# EAGLE design board (EAGLE 6.4)
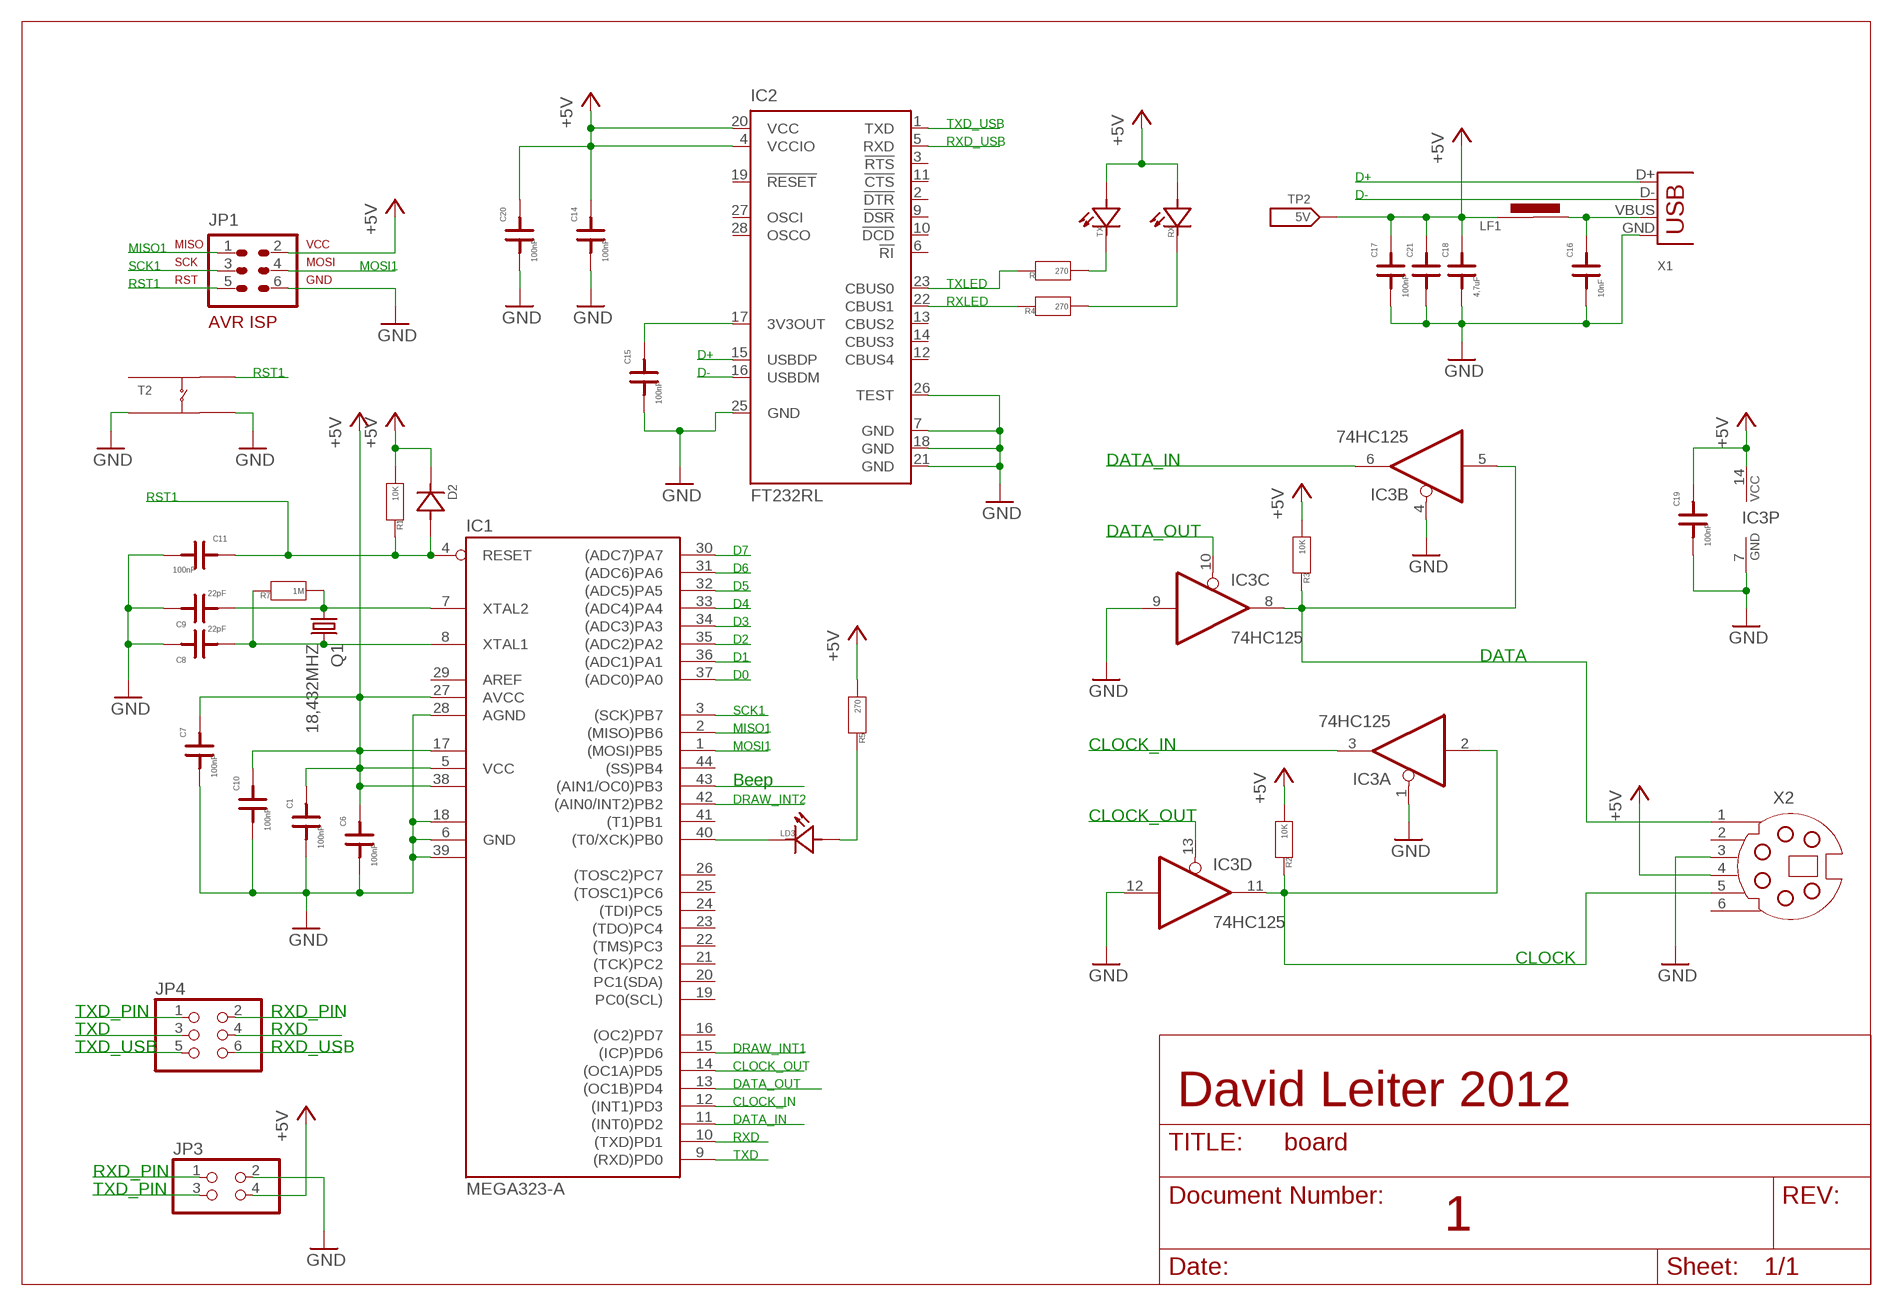
[diagram p0: schematic, sheet 1, part 1 of 2]
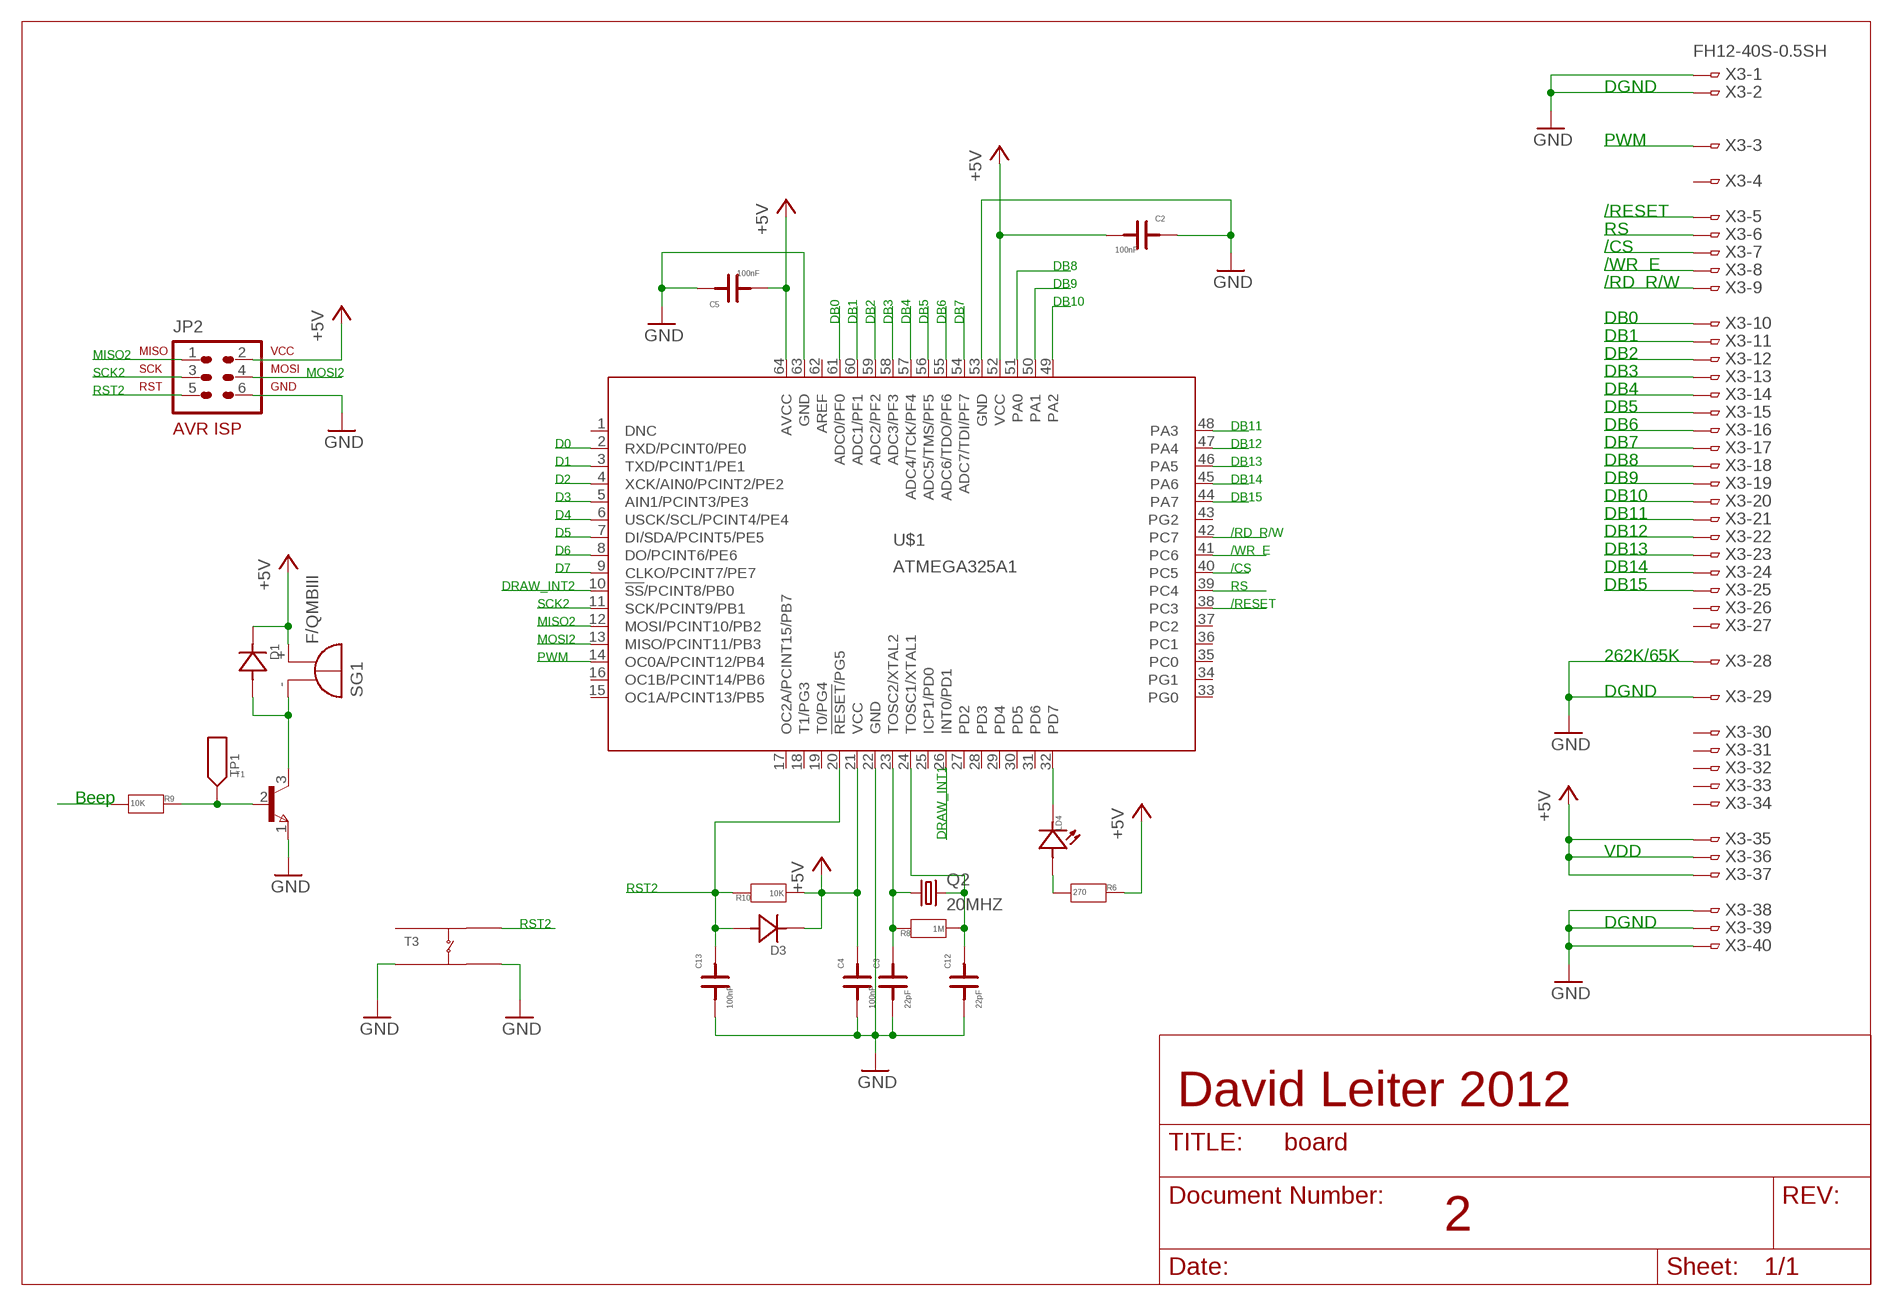
[diagram p1: schematic, sheet 1, part 2 of 2]

## Parts
C1  100nF  C1  [0805F]
C2  100nF  C1  [0805F]
C3  22pF  C1  [0805F]
C4  100nF  C1  [0805F]
C5  100nF  C1  [0805F]
C6  100nF  C1  [0805F]
C7  100nF  C1  [0805F]
C8  22pF  C1  [0805F]
C9  22pF  C1  [0805F]
C10  100nF  C1  [0805F]
C11  100nF  C1  [0805F]
C12  22pF  C1  [0805F]
C13  100nF  C1  [0805F]
C14  100nF  C1  [0805F]
C15  100nF  C1  [0805F]
C16  10nF  C1  [0805F]
C17  100nF  C1  [0805F]
C18  4,7uF  C1  [0805F]
C19  100nF  C1  [0805F]
C20  100nF  C1  [0805F]
C21  C1  [0805F]
D1  DSOD80  [SOD-80]
D2  DSOD80  [SOD-80]
D3  DSOD80  [SOD-80]
IC1  MEGA323-A  [TQFP44]
IC2  FT232RL  [SSOP28]
IC3  74HC125  74HCT125D  [SO14]
JP1  ISP1  AVR-ISP-6VERT  [AVR-ISP-6]
JP2  ISP2  AVR-ISP-6VERT  [AVR-ISP-6]
JP3  PINHD-2X2/90  [2X02/90]
JP4  PINHD-2X3  [2X03]
LD3  LEDSMD  [0805LED]
LD4  LEDSMD  [0805LED]
LF1  FERRIT0805  [0805]
Q1  18,432MHZ  CRYSTALHC49UP  [HC49UP]
Q2  20MHZ  CRYSTALHC49UP  [HC49UP]
R  270  R1  [0805]
R1  10K  R1  [0805]
R2  10K  R1  [0805]
R3  10K  R1  [0805]
R4  270  R1  [0805]
R5  270  R1  [0805]
R6  270  R1  [0805]
R7  1M  R1  [0805]
R8  1M  R1  [0805]
R9  10K  R1  [0805]
R10  10K  R1  [0805]
RX  LEDSMD  [0805LED]
SG1  F/QMBIII  [F/QMBIII]
T1  BC817  [SOT-23]
T2  TASTERSMD  [TASTE_SMD]
T3  TASTERSMD  [TASTE_SMD]
TP1  TESTPOINT  [TESTPOINT]
TP2  5V  TESTPOINT  [TESTPOINT]
TX  LEDSMD  [0805LED]
U$1  ATMEGA325A1  [TQFP64]
X1  USB-B-H  [USB-B-H]
X2  SSV-G06  [SSV-BC06]
X3  FH12-40S-0.5SH  [FH12-40S-0.5SH]

## Nets
+5V: C1.2 C2.1 C4.2 C5.1 C6.2 C7.2 C10.2 C14.2 C17.2 C18.2 C19.2 C20.2 C21.2 D1.1(K) D2.1(K) D3.1(K) IC1.5(VCC) IC1.17(VCC1) IC1.27(AVCC) IC1.38(VCC2) IC2.4(VCCIO) IC2.20(VCC) IC3.14(P:VCC) JP1.2 JP2.2 JP3.4 LF1.1 R1.1 R2.1 R3.1 R5.1 R6.2 R10.1 RX.A SG1.+(-) TP2.P$1(TP) TX.A U$1.21(VCC) U$1.52(VCC) U$1.64(AVCC) X2.4 X3.35 X3.36 X3.37
/CS: U$1.40(PC5) X3.7
/RD: U$1.42(PC7) X3.9
/RESET: U$1.38(PC3) X3.5
/WR: U$1.41(PC6) X3.8
BEEP: IC1.43((AIN1/OC0)PB3) R9.1
CLOCK: IC3.2(A:I) IC3.11(D:O) R2.2 X2.5
CLOCK_IN: IC1.12((INT1)PD3) IC3.3(A:O)
CLOCK_OUT: IC1.14((OC1A)PD5) IC3.13(D:OE)
D0: IC1.37((ADC0)PA0) U$1.2(RXD/PCINT0/PE0)
D1: IC1.36((ADC1)PA1) U$1.3(TXD/PCINT1/PE1)
D2: IC1.35((ADC2)PA2) U$1.4(XCK/AIN0/PCINT2/PE2)
D3: IC1.34((ADC3)PA3) U$1.5(AIN1/PCINT3/PE3)
D4: IC1.33((ADC4)PA4) U$1.6(USCK/SCL/PCINT4/PE4)
D5: IC1.32((ADC5)PA5) U$1.7(DI/SDA/PCINT5/PE5)
D6: IC1.31((ADC6)PA6) U$1.8(DO/PCINT6/PE6)
D7: IC1.30((ADC7)PA7) U$1.9(CLKO/PCINT7/PE7)
D+: IC2.15(USBDP) X1.D+
D-: IC2.16(USBDM) X1.D-
DATA: IC3.5(B:I) IC3.8(C:O) R3.2 X2.1
DATA_IN: IC1.11((INT0)PD2) IC3.6(B:O)
DATA_OUT: IC1.13((OC1B)PD4) IC3.10(C:OE)
DB0: U$1.61(ADC0/PF0) X3.10
DB1: U$1.60(ADC1/PF1) X3.11
DB2: U$1.59(ADC2/PF2) X3.12
DB3: U$1.58(ADC3/PF3) X3.13
DB4: U$1.57(ADC4/TCK/PF4) X3.14
DB5: U$1.56(ADC5/TMS/PF5) X3.15
DB6: U$1.55(ADC6/TDO/PF6) X3.16
DB7: U$1.54(ADC7/TDI/PF7) X3.17
DB8: U$1.51(PA0) X3.18
DB9: U$1.50(PA1) X3.19
DB10: U$1.49(PA2) X3.20
DB11: U$1.48(PA3) X3.21
DB12: U$1.47(PA4) X3.22
DB13: U$1.46(PA5) X3.23
DB14: U$1.45(PA6) X3.24
DB15: U$1.44(PA7) X3.25
DRAW_INT1: IC1.15((ICP)PD6) U$1.26(INT0/PD1)
DRAW_INT2: IC1.42((AIN0/INT2)PB2) U$1.10(!SS!/PCINT8/PB0)
GND: C1.1 C2.2 C3.1 C4.1 C5.2 C6.1 C7.1 C8.2 C9.2 C10.1 C11.1 C12.1 C13.1 C14.1 C15.1 C16.1 C17.1 C18.1 C19.1 C20.1 C21.1 IC1.6(GND) IC1.18(GND1) IC1.28(AGND) IC1.39(GND2) IC2.7(GND) IC2.18(GND) IC2.21(GND) IC2.25(GND) IC2.26(TEST) IC3.1(A:OE) IC3.4(B:OE) IC3.7(P:GND) IC3.9(C:I) IC3.12(D:I) JP1.6 JP2.6 JP3.2 T1.1(E) T2.B1 T2.B2 T3.B1 T3.B2 U$1.22(GND) U$1.53(GND) U$1.63(GND) X1.GND X2.3 X3.1 X3.2 X3.28 X3.29 X3.38 X3.39 X3.40
MISO1: IC1.2((MISO)PB6) JP1.1
MISO2: JP2.1 U$1.13(MISO/PCINT11/PB3)
MOSI1: IC1.1((MOSI)PB5) JP1.4
MOSI2: JP2.4 U$1.12(MOSI/PCINT10/PB2)
N$1: IC1.40((T0/XCK)PB0) LD3.K
N$2: D1.2(A) SG1.-(+) T1.3(C)
N$3: C8.1 IC1.8(XTAL1) Q1.2 R7.2
N$4: C9.1 IC1.7(XTAL2) Q1.1 R7.1
N$5: LD3.A R5.2
N$6: C3.2 Q2.1 R8.2 U$1.23(TOSC2/XTAL2)
N$7: IC2.22(CBUS1) R4.2
N$8: R9.2 T1.2(B) TP1.P$1(TP)
N$9: LD4.K U$1.32(PD7)
N$10: C15.2 IC2.17(3V3OUT)
N$11: LD4.A R6.1
N$12: R.1 TX.K
N$13: C12.2 Q2.2 R8.1 U$1.24(TOSC1/XTAL1)
N$14: IC2.23(CBUS0) R.2
N$15: R4.1 RX.K
PWM: U$1.14(OC0A/PCINT12/PB4) X3.3
RS: U$1.39(PC4) X3.6
RST1: C11.2 D2.2(A) IC1.4(RESET) JP1.5 R1.2 T2.A2
RST2: C13.2 D3.2(A) JP2.5 R10.2 T3.A2 U$1.20(!RESET!/PG5)
RXD: IC1.10((TXD)PD1) JP4.4
RXD_PIN: JP3.1 JP4.2
RXD_USB: IC2.5(RXD) JP4.6
SCK1: IC1.3((SCK)PB7) JP1.3
SCK2: JP2.3 U$1.11(SCK/PCINT9/PB1)
TXD: IC1.9((RXD)PD0) JP4.3
TXD_PIN: JP3.3 JP4.1
TXD_USB: IC2.1(TXD) JP4.5
VBUS: C16.2 LF1.2 X1.VBUS
Unconnected: IC1.16((OC2)PD7) IC1.19(PC0(SCL)) IC1.20(PC1(SDA)) IC1.21((TCK)PC2) IC1.22((TMS)PC3) IC1.23((TDO)PC4) IC1.24((TDI)PC5) IC1.25((TOSC1)PC6) IC1.26((TOSC2)PC7) IC1.29(AREF) IC1.41((T1)PB1) IC1.44((SS)PB4) IC2.2(!DTR) IC2.3(!RTS) IC2.6(!RI) IC2.9(!DSR) IC2.10(!DCD) IC2.11(!CTS) IC2.12(CBUS4) IC2.13(CBUS2) IC2.14(CBUS3) IC2.19(!RESET) IC2.27(OSCI) IC2.28(OSCO) T2.A1 T3.A1 U$1.1(DNC) U$1.15(OC1A/PCINT13/PB5) U$1.16(OC1B/PCINT14/PB6) U$1.17(OC2A/PCINT15/PB7) U$1.18(T1/PG3) U$1.19(T0/PG4) U$1.25(ICP1/PD0) U$1.27(PD2) U$1.28(PD3) U$1.29(PD4) U$1.30(PD5) U$1.31(PD6) U$1.33(PG0) U$1.34(PG1) U$1.35(PC0) U$1.36(PC1) U$1.37(PC2) U$1.43(PG2) U$1.62(AREF) X2.2 X2.6 X3.4 X3.26 X3.27 X3.30 X3.31 X3.32 X3.33 X3.34

## Notes on the sheet
- DGND
- TXD_USB
- RXD_USB | PWM
- D+
- D-
- /RESET
- RS
- MISO1 | /CS
- SCK1 | MOSI1 | DB8 | /WR  E
- RST1 | TXLED | DB9 | /RD  R/W
- RXLED | DB10
- DB0 | DB1 | DB2 | DB3 | DB4 | DB5 | DB6 | DB7 | DB0
- DB1
- D+ | MISO2 | DB2
- RST1 | D- | SCK2 | MOSI2 | DB3
- RST2 | DB4
- DB5
- DB11 | DB6
- D0 | DB12 | DB7
- DATA_IN | D1 | DB13 | DB8
- D2 | DB14 | DB9
- RST1 | D3 | DB15 | DB10
- D4 | DB11
- DATA_OUT | D5 | /RD  R/W | DB12
- D7 | D6 | /WR  E | DB13
- D6 | D7 | /CS | DB14
- D5 | DRAW_INT2 | RS | DB15
- D4 | SCK2 | /RESET
- D3 | MISO2
- D2 | MOSI2
- D1 | DATA | PWM | 262K/65K
- D0
- DGND
- SCK1
- MISO1
- MOSI1 | CLOCK_IN
- Beep
- DRAW_INT2 | Beep
- CLOCK_OUT
- DRAW_INT1
- VDD
- RST2
- RST2 | DGND
- CLOCK
- TXD_PIN | RXD_PIN
- TXD | RXD
- TXD_USB | RXD_USB | DRAW_INT1
- CLOCK_OUT
- DATA_OUT
- CLOCK_IN | David Leiter 2012 | David Leiter 2012
- DATA_IN
- RXD
- TXD
- RXD_PIN
- TXD_PIN
- 1 | 2

## Library data of the parts
C1-C21 = Gob_L:C
D1-D3 = Gob_L:D: Normale Diode, Typ 1N4148
IC1 = atmel:MEGA323: MICROCONTROLLER 32 Kbytes FLASH 2 Kbytes SRAM 1 Kbytes EEPROM USART 8-channel 10 bit ADC Source: avr.lbr; OC_FARNELL: unknown; OC_NEWARK: unknown
IC2 = ftdichip:FT232R: Source: http://www.ftdichip.com/Documents/DataSheets/DS_FT232R_v104.pdf; MPN: FT232RL; OC_FARNELL: 1146032; OC_NEWARK: 91K9918
IC3 = 74xx-eu:74*125: Quad bus BUFFER, 3-state
JP1 JP2 = avr-7:AVR-ISP-6: AVR ISP-6 Serial Programming Header
JP3 = pinhead:PINHD-2X2: PIN HEADER
JP4 = pinhead:PINHD-2X3: PIN HEADER
LD3 LD4 RX TX = Gob_L:LED: Led´s in allen Formen
LF1 = Gob_L:FERRIT: SMD-Ferrit-Induktor Adimpex PB-322513-900-NT 0,3 Ohm@DC, 90 Ohm@100MHz Imax = 400mA
Q1 Q2 = crystal:CRYSTAL: CRYSTAL; OC_FARNELL: unknown; OC_NEWARK: unknown
R R1-R10 = Gob_L:R: Widerstand 400 mil - 0805 - 1206
SG1 = buzzer:F/QMBIII: BUZZER Source: Buerklin; OC_FARNELL: unknown; OC_NEWARK: unknown
T1 = Gob_L:BC817
T2 T3 = Gob_L:TASTER: Taste SMD, Typ DIPTRONICS DTSM-644K Distrelec-Best.Nr: 200312
TP1 TP2 = Gob_L:TESTPOINT: TestPoint für Messungen etc.
U$1 = atmega325A:ATMEGA325A
X1 = con-usb-3:USB: USB Connectors
X2 = con-yamaichi:SSV-G06: YAMAICHI CONNECTOR; OC_FARNELL: unknown; OC_NEWARK: unknown
X3 = con-hirose:FH12-40S-0.5S: 0.5mm Pitch Connectors For FPC/FFC Source: Data sheet <http://www.hirose.co.jp/cataloge_hp/e58605370.pdf>; MPN: FH12-40S-0.5SH(55); OC_FARNELL: 1324556; OC_NEWARK: 34M6178

## Board
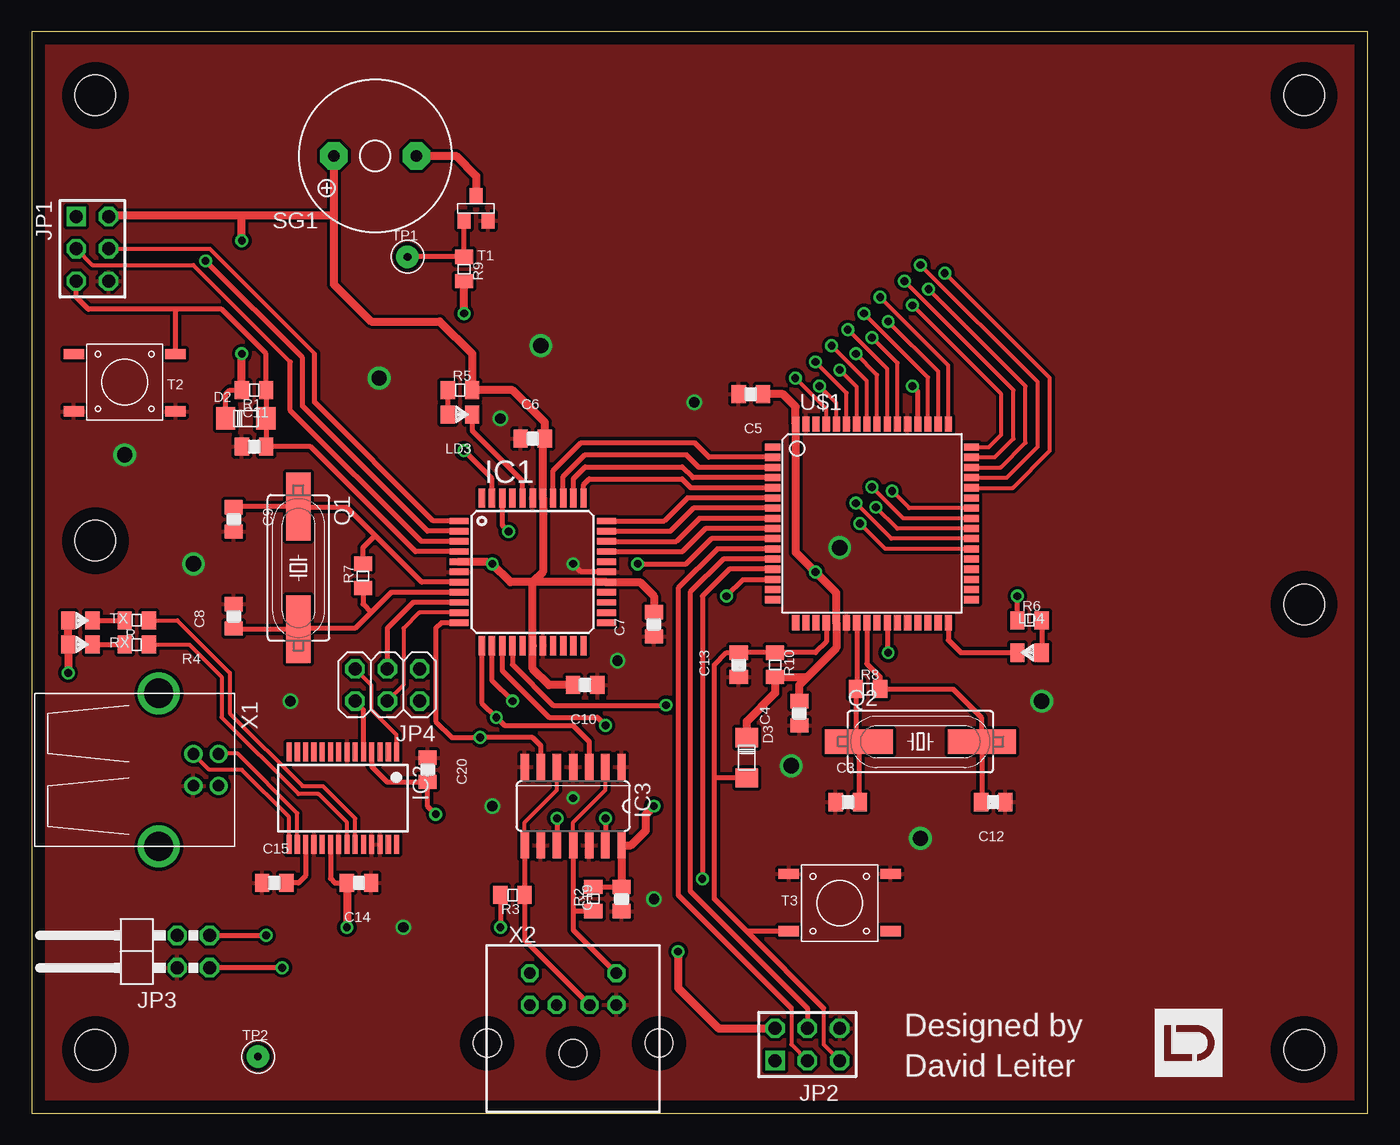
[diagram p2: board, top side]
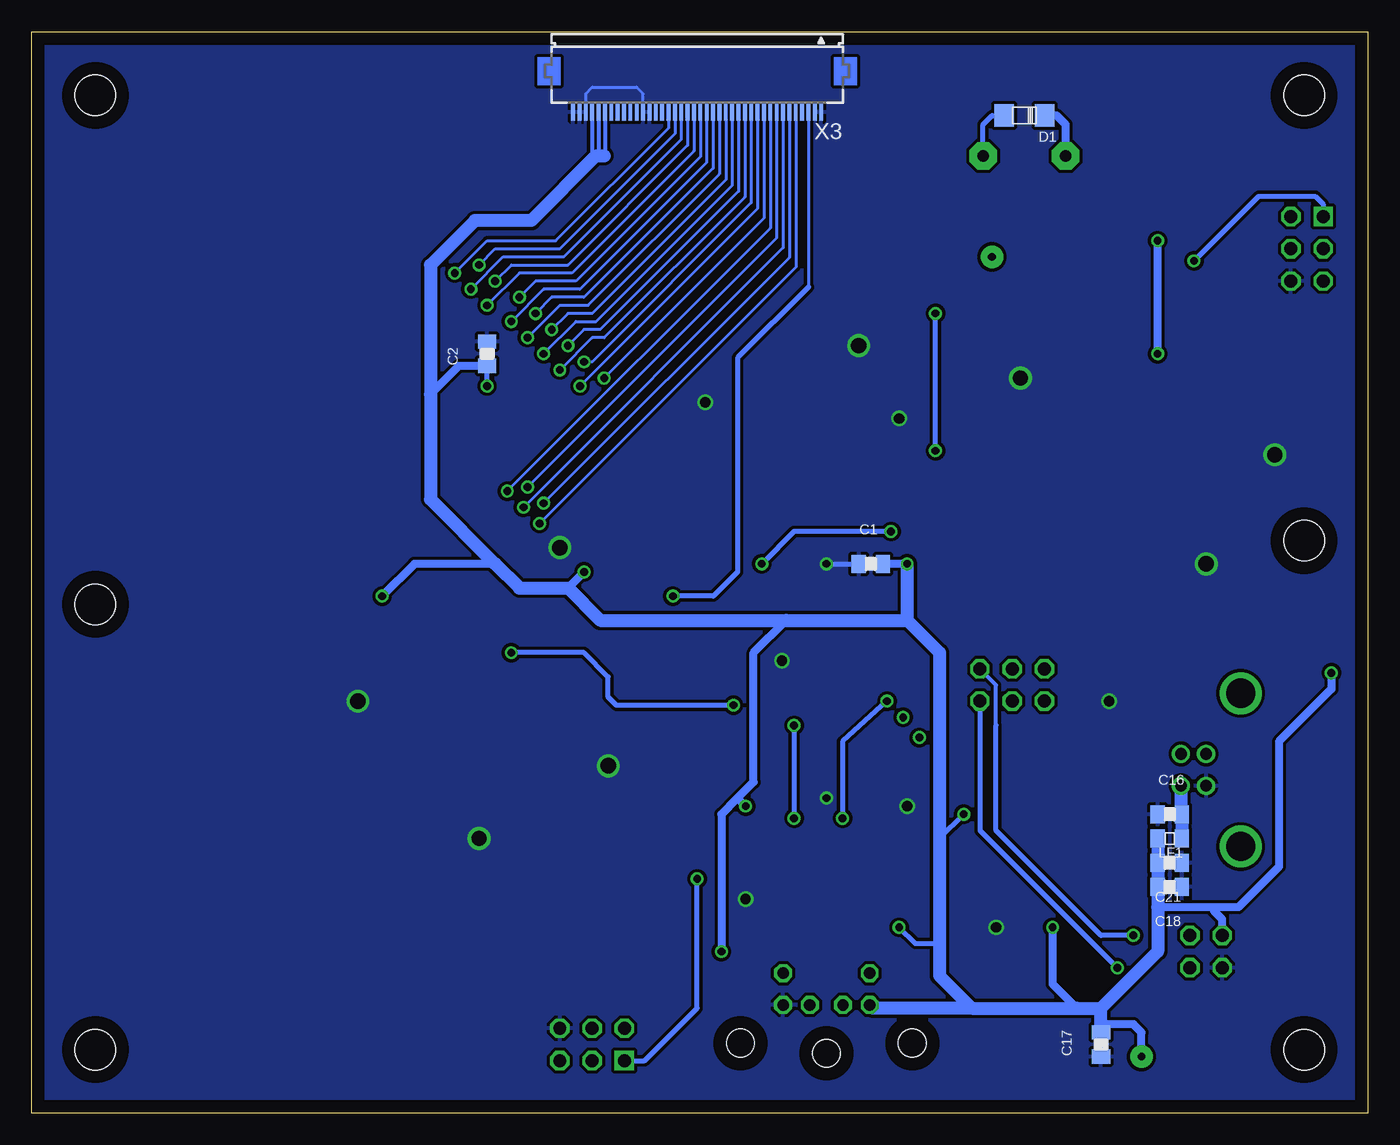
[diagram p3: board, bottom side, seen from below]

Size 105 x 85 mm. Coordinates in mm from the lower left corner, seen from the top.
Outline: 0,0 105,0 105,85 0,85 0,0
Copper layers (1*16): Top 0.035mm / dielectric 1.5mm / Bottom 0.035mm
Design rules "default": minimum track width 10mil, minimum drill 24mil, track to track 8mil, track to pad 8mil, pad to pad 8mil, via to via 8mil, smd to smd 8mil, copper to edge 40mil, drill to drill 8mil, minimum pad ring 10mil, minimum via ring 8mil, stop-mask expansion 4mil, vias tented up to drill 0mil, thermal gap 10mil
Holes 3.2 mm at 5,80 100,80 100,5 5,5 5,45 100,40
Milling: 4 lines

### Footprints (pad centres in the part's own frame; a part is rotated, then mirrored left to right if it is on the bottom)
0805F = smd 1.118 x 1.422: 1 -0.953,0; 2 0.953,0
SOD-80 = smd 1.524 x 1.778: 1 -1.587,0; 2 1.587,0
TQFP44 = smd 1.5 x 0.5: 1 -5.8,4; 2 -5.8,3.2; 3 -5.8,2.4; 4 -5.8,1.6; 5 -5.8,0.8; 6 -5.8,0; 7 -5.8,-0.8; 8 -5.8,-1.6; 9 -5.8,-2.4; 10 -5.8,-3.2; 11 -5.8,-4; 23 5.8,-4; 24 5.8,-3.2; 25 5.8,-2.4; 26 5.8,-1.6; 27 5.8,-0.8; 28 5.8,0; 29 5.8,0.8; 30 5.8,1.6; 31 5.8,2.4; 32 5.8,3.2; 33 5.8,4 | smd 0.5 x 1.5: 12 -4,-5.8; 13 -3.2,-5.8; 14 -2.4,-5.8; 15 -1.6,-5.8; 16 -0.8,-5.8; 17 0,-5.8; 18 0.8,-5.8; 19 1.6,-5.8; 20 2.4,-5.8; 21 3.2,-5.8; 22 4,-5.8; 34 4,5.8; 35 3.2,5.8; 36 2.4,5.8; 37 1.6,5.8; 38 0.8,5.8; 39 0,5.8; 40 -0.8,5.8; 41 -1.6,5.8; 42 -2.4,5.8; 43 -3.2,5.8; 44 -4,5.8
SSOP28 = smd 0.4 x 1.5: 1 -4.225,-3.625; 2 -3.575,-3.625; 3 -2.925,-3.625; 4 -2.275,-3.625; 5 -1.625,-3.625; 6 -0.975,-3.625; 7 -0.325,-3.625; 8 0.325,-3.625; 9 0.975,-3.625; 10 1.625,-3.625; 11 2.275,-3.625; 12 2.925,-3.625; 13 3.575,-3.625; 14 4.225,-3.625; 15 4.225,3.625; 16 3.575,3.625; 17 2.925,3.625; 18 2.275,3.625; 19 1.625,3.625; 20 0.975,3.625; 21 0.325,3.625; 22 -0.325,3.625; 23 -0.975,3.625; 24 -1.625,3.625; 25 -2.275,3.625; 26 -2.925,3.625; 27 -3.575,3.625; 28 -4.225,3.625
SO14 = smd 0.66 x 2.032: 1 -3.81,-3.073; 2 -2.54,-3.073; 3 -1.27,-3.073; 4 0,-3.073; 5 1.27,-3.073; 6 2.54,-3.073; 7 3.81,-3.073; 8 3.81,3.073; 9 2.54,3.073; 10 1.27,3.073; 11 0,3.073; 12 -1.27,3.073; 13 -2.54,3.073; 14 -3.81,3.073
AVR-ISP-6 = drill 1.016 square: 1 -2.54,-1.27 | drill 1.016 octagon: 2 -2.54,1.27; 3 0,-1.27; 4 0,1.27; 5 2.54,-1.27; 6 2.54,1.27
2X02/90 = drill 1.016 octagon: 1 -1.27,-6.35; 2 -1.27,-3.81; 3 1.27,-6.35; 4 1.27,-3.81
2X03 = drill 1.016 octagon: 1 -2.54,-1.27; 2 -2.54,1.27; 3 0,-1.27; 4 0,1.27; 5 2.54,-1.27; 6 2.54,1.27
0805LED = smd 1.118 x 1.422: A 0.953,0; K -0.953,0
0805 = smd 1.118 x 1.422: 1 -0.953,0; 2 0.953,0
HC49UP = smd 5.334 x 1.93: 1 -4.826,0; 2 4.826,0
F/QMBIII = drill 0.914 pad 2.159 octagon: + 3.251,0; - -3.251,0
SOT-23 = smd 1.016 x 1.27: 1 -0.953,0.953; 2 0.953,0.953; 3 0,-0.953
TASTE_SMD = smd 1.6 x 0.8: A1 -4,2.2; A2 4,2.2; B1 -4,-2.3; B2 4,-2.3
TESTPOINT = drill 0.61 pad 1.778: P$1 0,0
TQFP64 = smd 1.194 x 0.559: 1 -7.8,6; 2 -7.8,5.2; 3 -7.8,4.4; 4 -7.8,3.6; 5 -7.8,2.8; 6 -7.8,2; 7 -7.8,1.2; 8 -7.8,0.4; 9 -7.8,-0.4; 10 -7.8,-1.2; 11 -7.8,-2; 12 -7.8,-2.8; 13 -7.8,-3.6; 14 -7.8,-4.4; 15 -7.8,-5.2; 16 -7.8,-6; 33 7.8,-6; 34 7.8,-5.2; 35 7.8,-4.4; 36 7.8,-3.6; 37 7.8,-2.8; 38 7.8,-2; 39 7.8,-1.2; 40 7.8,-0.4; 41 7.8,0.4; 42 7.8,1.2; 43 7.8,2; 44 7.8,2.8; 45 7.8,3.6; 46 7.8,4.4; 47 7.8,5.2; 48 7.8,6 | smd 0.559 x 1.194: 17 -6,-7.8; 18 -5.2,-7.8; 19 -4.4,-7.8; 20 -3.6,-7.8; 21 -2.8,-7.8; 22 -2,-7.8; 23 -1.2,-7.8; 24 -0.4,-7.8; 25 0.4,-7.8; 26 1.2,-7.8; 27 2,-7.8; 28 2.8,-7.8; 29 3.6,-7.8; 30 4.4,-7.8; 31 5.2,-7.8; 32 6,-7.8; 49 6,7.8; 50 5.2,7.8; 51 4.4,7.8; 52 3.6,7.8; 53 2.8,7.8; 54 2,7.8; 55 1.2,7.8; 56 0.4,7.8; 57 -0.4,7.8; 58 -1.2,7.8; 59 -2,7.8; 60 -2.8,7.8; 61 -3.6,7.8; 62 -4.4,7.8; 63 -5.2,7.8; 64 -6,7.8
USB-B-H = drill 0.914: D+ 0,1.25; D- 1.981,1.25; GND 0,-1.25; VBUS 1.981,-1.25 | drill 2.286: P$1 -2.718,-6.02; P$2 -2.718,6.02
SSV-BC06 = drill 0.9 octagon: 1 1.3,8.5; 2 -1.3,8.5; 3 3.4,8.5; 4 -3.4,8.5; 5 3.4,11; 6 -3.4,11 | hole 2.2: -6.75,5.5; 0,4.7; 6.75,5.5
FH12-40S-0.5SH = smd 0.3 x 1.3: 1 -9.75,3.25; 2 -9.25,3.25; 3 -8.75,3.25; 4 -8.25,3.25; 5 -7.75,3.25; 6 -7.25,3.25; 7 -6.75,3.25; 8 -6.25,3.25; 9 -5.75,3.25; 10 -5.25,3.25; 11 -4.75,3.25; 12 -4.25,3.25; 13 -3.75,3.25; 14 -3.25,3.25; 15 -2.75,3.25; 16 -2.25,3.25; 17 -1.75,3.25; 18 -1.25,3.25; 19 -0.75,3.25; 20 -0.25,3.25; 21 0.25,3.25; 22 0.75,3.25; 23 1.25,3.25; 24 1.75,3.25; 25 2.25,3.25; 26 2.75,3.25; 27 3.25,3.25; 28 3.75,3.25; 29 4.25,3.25; 30 4.75,3.25; 31 5.25,3.25; 32 5.75,3.25; 33 6.25,3.25; 34 6.75,3.25; 35 7.25,3.25; 36 7.75,3.25; 37 8.25,3.25; 38 8.75,3.25; 39 9.25,3.25; 40 9.75,3.25

### Placement (x,y rotation side)
C1  39.05,43.18 0 bottom
C2  69.22,59.69 90 bottom
C3  64.14,24.45 0 top
C4  60.33,31.43 90 top
C5  56.52,56.52 180 top
C6  39.37,53.02 0 top
C7  48.9,38.42 90 top
C8  15.88,39.05 90 top
C9  15.88,46.67 270 top
C10  43.5,33.66 180 top
C11  17.46,52.39 0 top
C12  75.56,24.45 180 top
C13  55.56,35.24 90 top
C14  25.72,18.1 180 top
C15  19.05,18.1 0 top
C16  15.56,23.5 0 bottom
C17  20.95,5.4 90 bottom
C18  15.56,17.78 180 bottom
C19  46.35,16.83 90 top
C20  31.11,26.99 270 top
C21  15.56,19.68 180 bottom
D1  26.99,78.42 180 bottom
D2  16.83,54.61 0 top
D3  56.2,27.94 270 top
IC1  39.37,42.55 0 top
IC2  24.45,24.77 180 top
IC3  42.55,24.13 180 top
JP1  4.76,67.94 270 top
JP2  60.96,5.4 0 top
JP3  7.62,12.7 90 top
JP4  27.94,33.66 180 top
LD3  33.66,54.93 180 top
LD4  78.42,36.2 0 top
LF1  15.56,21.59 0 bottom
Q1  20.95,42.86 270 top
Q2  69.85,29.21 0 top
R  8.26,38.73 0 top
R1  17.46,56.83 0 top
R2  44.13,16.83 270 top
R3  37.78,17.14 0 top
R4  8.26,36.83 0 top
R5  33.66,56.83 180 top
R6  78.42,38.73 180 top
R7  26.04,42.23 270 top
R8  65.72,33.34 180 top
R9  33.97,66.36 90 top
R10  58.42,35.24 90 top
RX  3.81,36.83 180 top
SG1  26.99,75.25 180 top
T1  34.92,71.12 180 top
T2  7.3,57.47 0 top
T3  63.5,16.51 180 top
TP1  29.53,67.31 0 top
TP2  17.78,4.45 0 top
TX  3.81,38.73 180 top
U$1  66.04,46.35 0 top
X1  12.7,26.99 0 top
X2  42.55,0 0 top
X3  52.7,81.92 180 bottom

### Tracks (layer width: path | path; a pad name or v marks a point on that pad's centre or on a via)
+5V  (via drill 0.61, 0.61 pad 0.25)
  Top 0.406: R6.2 v77.47,40.64 | U$1.52 69.64,56.73 v69.22,57.15 | IC2.4 26.72,27.25 27.94,26.04 C20.2 31.11,24.13 v31.75,23.5 | IC2.20 23.47,18.44 23.81,18.1 C14.2 | R3.1 v36.83,14.61 | R2.1 C19.2 | D2.1 15.24,56.52 15.56,56.83 R1.1
  Top 0.61: C5.1 59.05,56.52 60.04,55.53 U$1.64 60.04,44.1 v61.59,42.55 63.24,40.9 U$1.21 63.24,36.57 60.96,34.29 | IC1.5 35.73,43.34 v36.2,43.18 37.63,41.74 39.37,41.74 | 60.96,34.29 R10.1 58.42,33.02 56.2,30.8 D3.1 | C7.2 48.9,40.64 47.79,41.74 IC1.27 39.37,41.74 | C10.2 40.64,33.66 39.37,34.92 IC1.17 39.37,41.74 | 39.37,41.74 40.17,42.55 IC1.38 40.17,53.19 C6.2 40.32,54.29 37.78,56.83 R5.1 34.61,59.69 32.07,62.23 26.67,62.23 23.74,65.16 23.74,70.56 | C14.2 v24.77,14.61 | SG1.+ 23.74,70.56 | 23.74,70.56 16.51,70.56 | 16.51,70.56 5.79,70.56 JP1.2 | R1.1 v16.51,59.69 | v50.8,12.7 50.8,9.84 53.98,6.67 JP2.2 | v16.51,68.58 16.51,70.56 | TX.A RX.A v2.86,34.61 | C4.2 60.33,33.66 60.96,34.29 | C19.2 IC3.14 47.09,21.06 48.26,22.23 48.26,23.5 v48.9,24.13
  Bottom 0.305: X3.35 59.95,75.3 60.01,75.25 | X3.36 60.45,75.44 60.64,75.25 60.95,75.57 X3.37
  Bottom 0.406: v69.22,57.15 C2.1 | v31.75,23.5 33.66,21.59 | v36.83,14.61 35.56,13.34 33.66,13.34
  Bottom 0.61: v36.2,43.18 C1.2 | 68.58,43.18 74.93,43.18 v77.47,40.64 | 49.53,24.77 50.8,23.5 v50.8,12.7 | 49.53,24.77 48.26,26.04 48.26,36.2 45.72,38.73 | SG1.+ 23.74,77.71 24.45,78.42 D1.1 | v16.51,59.69 v16.51,68.58 | TP2.P$1 17.78,6.35 18.41,6.99 20.95,6.99 | JP3.4 11.43,15.24 12.06,15.88 12.06,16.19 | 12.06,16.19 16.51,16.19 | 62.87,41.27 v61.59,42.55 | C2.1 71.44,58.74 73.66,56.52 | v24.77,14.61 24.77,10.16 22.86,8.26 | v2.86,34.61 2.86,33.34 6.99,29.21 6.99,19.37 10.16,16.19 12.06,16.19 | v48.9,24.13 49.53,24.77
  Bottom 1.016: 36.2,38.73 45.72,38.73 60.33,38.73 62.87,41.27 66.67,41.27 68.58,43.18 73.66,48.26 73.66,56.52 73.66,66.67 70.17,70.17 65.72,70.17 60.64,75.25 60.01,75.25 | 36.2,38.73 33.66,36.2 33.66,21.59 33.66,13.34 33.66,10.79 31.11,8.26 | 36.2,38.73 v36.2,43.18 | 31.11,8.26 38.9,8.26 X2.4 | 31.11,8.26 22.86,8.26 20.95,8.26 | C17.2 20.95,6.99 20.95,8.26 | 20.95,8.26 16.51,12.7 16.51,16.19 C18.2 C21.2 LF1.1
/CS  (via drill 0.61)
  Top 0.305: U$1.40 68.03,45.95 v66.36,47.62
  Bottom 0.254: X3.7 45.95,68.03 v66.36,47.62
/RD  (via drill 0.61)
  Top 0.305: U$1.42 68.97,47.55 v67.63,48.9
  Bottom 0.254: X3.9 46.95,69.57 v67.63,48.9
/RESET  (via drill 0.61)
  Top 0.305: U$1.38 67.09,44.35 v65.09,46.35
  Bottom 0.254: X3.5 44.95,66.49 v65.09,46.35
/WR  (via drill 0.61)
  Top 0.305: U$1.41 68.5,46.76 v66.04,49.21
  Bottom 0.254: X3.8 46.45,68.8 v66.04,49.21
BEEP  (via drill 0.61)
  Top 0.406: IC1.43 36.17,49.87 v33.97,52.07
  Top 0.61: v33.97,62.87 R9.1
  Bottom 0.406: v33.97,52.07 v33.97,62.87
CLOCK
  Top 0.305: IC3.11 42.55,22.86 45.09,25.4 IC3.2
  Top 0.406: IC3.11 42.55,15.88 | 42.55,15.88 42.55,14.4 X2.5 | R2.2 42.55,15.88
CLOCK_IN  (via drill 0.61)
  Top 0.406: IC1.12 35.37,32.26 v36.51,31.11 37.15,30.48 42.55,30.48 43.81,29.21 IC3.3
CLOCK_OUT  (via drill 0.61)
  Top 0.406: IC1.14 36.97,34.78 40.64,31.11 44.45,31.11 v45.09,30.48 | v45.09,23.18 IC3.13
  Bottom 0.406: v45.09,30.48 v45.09,23.18
D0
  Top 0.406: U$1.2 53.22,51.55 52.07,52.7 43.18,52.7 40.97,50.49 IC1.37
D1
  Top 0.406: U$1.3 52.43,50.76 51.44,51.75 43.5,51.75 41.77,50.02 IC1.36
D2
  Top 0.406: U$1.4 51.96,49.95 51.12,50.8 43.5,50.8 42.57,49.87 IC1.35
D3
  Top 0.406: U$1.5 51.81,49.16 51.12,49.85 43.81,49.85 43.37,49.4 IC1.34
D4
  Top 0.406: U$1.6 51.53,48.35 49.72,46.55 IC1.33
D5
  Top 0.406: U$1.7 52,47.55 50.19,45.74 IC1.32
D6
  Top 0.406: U$1.8 52.47,46.76 50.66,44.95 IC1.31
D7
  Top 0.406: U$1.9 52.94,45.95 51.13,44.15 IC1.30
D+
  Top 0.305: IC2.15 20.22,23.27 16.51,26.99 13.95,26.99 X1.D+
D-
  Top 0.305: X1.D- 14.7,28.26 16.19,28.26 20.87,23.58 IC2.16
DATA
  Top 0.305: IC3.8 38.73,22.86 41.27,25.4 IC3.5
  Top 0.406: IC3.8 R3.2 38.73,13.61 X2.1
DATA_IN  (via drill 0.61)
  Top 0.406: IC1.11 32.2,38.55 31.75,38.1 31.75,30.8 33.02,29.53 v35.24,29.53 39.37,29.53 40.01,28.89 IC3.6
DATA_OUT  (via drill 0.61)
  Top 0.406: v37.78,32.38 36.2,33.97 36.2,36.72 IC1.13 | v41.27,23.18 IC3.10
  Bottom 0.406: v37.78,32.38 41.27,29.21 v41.27,23.18
DB0  (via drill 0.61)
  Top 0.305: U$1.61 62.44,55.35 v60.01,57.78
  Bottom 0.254: X3.10 47.45,70.34 v60.01,57.78
DB1  (via drill 0.61)
  Top 0.305: U$1.60 63.24,55.82 v61.91,57.15
  Bottom 0.254: X3.11 47.95,71.11 v61.91,57.15
DB2  (via drill 0.61)
  Top 0.305: U$1.59 64.04,56.61 v61.59,59.05
  Bottom 0.254: X3.12 48.45,71.56 60.96,59.05 v61.59,59.05
DB3  (via drill 0.61)
  Top 0.305: U$1.58 64.84,57.08 v63.5,58.42
  Bottom 0.254: v63.5,58.42 60.96,60.96 60.01,60.96 48.95,72.01 X3.13
DB4  (via drill 0.61)
  Top 0.305: U$1.57 65.64,57.55 v62.87,60.33
  Bottom 0.254: X3.14 49.45,72.47 60.33,61.59 61.59,61.59 v62.87,60.33
DB5  (via drill 0.61)
  Top 0.305: U$1.56 66.44,58.02 v64.77,59.69
  Bottom 0.254: X3.15 49.95,72.92 60.64,62.23 62.23,62.23 v64.77,59.69
DB6  (via drill 0.61)
  Top 0.305: U$1.55 67.24,58.49 v64.14,61.59
  Bottom 0.254: v64.14,61.59 62.87,62.87 60.96,62.87 50.45,73.37 X3.16
DB7  (via drill 0.61)
  Top 0.305: U$1.54 68.04,58.96 v66.04,60.96
  Bottom 0.254: v66.04,60.96 63.5,63.5 61.28,63.5 50.95,73.82 X3.17
DB8  (via drill 0.61)
  Top 0.305: U$1.51 70.44,57.83 v65.41,62.87
  Bottom 0.254: X3.18 51.45,74.28 61.59,64.14 64.14,64.14 v65.41,62.87
DB9  (via drill 0.61)
  Top 0.305: U$1.50 71.24,58.3 v67.31,62.23
  Bottom 0.254: X3.19 51.95,74.73 61.91,64.77 64.77,64.77 v67.31,62.23
DB10  (via drill 0.61)
  Top 0.305: U$1.49 72.04,58.77 v66.67,64.14
  Bottom 0.254: X3.20 52.45,75.18 62.23,65.41 65.41,65.41 v66.67,64.14
DB11  (via drill 0.61)
  Top 0.305: U$1.48 75.22,52.35 76.2,53.34 76.2,56.52 v69.22,63.5
  Bottom 0.254: X3.21 52.95,75.63 62.55,66.04 66.67,66.04 v69.22,63.5
DB12  (via drill 0.61)
  Top 0.305: U$1.47 75.69,51.55 77.15,53.02 77.15,56.83 v68.58,65.41
  Bottom 0.254: X3.22 53.45,76.08 62.87,66.67 67.31,66.67 v68.58,65.41
DB13  (via drill 0.61)
  Top 0.305: U$1.46 76.16,50.76 78.11,52.7 78.11,57.15 v70.48,64.77
  Bottom 0.254: X3.23 53.95,76.54 63.18,67.31 67.94,67.31 v70.48,64.77
DB14  (via drill 0.61)
  Top 0.305: U$1.45 76.62,49.95 79.06,52.39 79.06,57.47 v69.85,66.67
  Bottom 0.254: X3.24 54.45,76.99 63.5,67.94 68.58,67.94 v69.85,66.67
DB15  (via drill 0.61)
  Top 0.305: U$1.44 77.09,49.16 80.01,52.07 80.01,57.78 v71.75,66.04
  Bottom 0.254: X3.25 54.95,77.44 63.82,68.58 69.22,68.58 v71.75,66.04
DRAW_INT1  (via drill 0.61)
  Top 0.406: IC1.15 37.77,35.26 40.96,32.07 v49.85,32.07 | v67.31,36.2 67.31,38.48 U$1.26
  Bottom 0.406: v49.85,32.07 59.05,32.07 59.69,32.7 59.69,34.29 61.59,36.2 v67.31,36.2
DRAW_INT2  (via drill 0.61)
  Top 0.406: IC1.42 36.97,46.22 v37.47,45.72 | v47.62,43.18 51.44,43.18 53.41,45.16 U$1.10
  Bottom 0.406: v37.47,45.72 45.09,45.72 v47.62,43.18
GND  (via drill 0.61, 0.8, 1.2)
  Top 0.406: IC1.28 43.18,42.55 v42.55,43.18
  Bottom 0.254: X3.29 56.95,80.13 57.47,80.64 60.96,80.64 61.45,80.15 X3.38
  Bottom 0.406: v42.55,43.18 C1.1
  other vias: 40.01,60.33 63.5,44.45 12.7,43.18 29.21,14.61 20.32,32.38 46.04,35.56 36.83,54.61 52.07,55.88 48.9,16.83 36.2,24.13 79.38,32.38 42.55,24.77 69.85,21.59 59.69,27.3 27.3,57.78 7.3,51.75
  pour Top (isolate 0.254): 0,85 105,85 105,0 0,0
  pour Bottom (isolate 0.254): -0.64,84.69 105,85 105,0 -0.64,-0.32
MISO1  (via drill 0.61)
  Top 0.406: IC1.2 31.09,45.74 21.27,55.56 21.27,59.37 v13.65,66.99
  Bottom 0.406: v13.65,66.99 8.57,72.07 | 8.57,72.07 4.13,72.07 | 4.13,72.07 3.49,71.44 JP1.1 | 8.57,72.07 4.13,72.07
MISO2  (via drill 0.61)
  Top 0.406: U$1.13 54.82,42.76 52.7,40.64 v52.7,18.41
  Bottom 0.406: JP2.1 56.83,4.13 52.7,8.26 v52.7,18.41
MOSI1
  Top 0.305: 22.23,59.69 13.97,67.94 JP1.4
  Top 0.406: IC1.1 31.56,46.55 22.23,55.88 22.23,59.69
MOSI2
  Top 0.406: U$1.12 54.35,43.55 51.75,40.96 51.75,17.46 60.96,8.26 JP2.4
N$1
  Top 0.406: IC1.40 38.57,49.7 34.61,53.66 LD3.K
N$2
  Top 0.61: SG1.- 33.34,75.25 34.92,73.66 T1.3
  Bottom 0.406: SG1.- 30.24,77.71 29.53,78.42 D1.2
N$3
  Top 0.406: IC1.8 28.25,40.95 26.67,39.37 | 26.67,39.37 25.4,38.1 21.65,38.1 Q1.2 16.57,38.04 C8.1 | R7.2 26.04,40.01 26.67,39.37
N$4
  Top 0.406: IC1.7 30.64,41.74 26.99,45.4 | 26.99,45.4 24.77,47.62 21.65,47.62 Q1.1 15.94,47.69 C9.1 | R7.1 26.04,44.45 26.99,45.4
N$5
  Top 0.406: LD3.A R5.2
N$6
  Top 0.406: U$1.23 64.84,33.41 R8.2 64.77,28.83 Q2.1 65.02,25.15 C3.2
N$7
  Top 0.305: R4.2 12.38,36.83 14.92,34.29 14.92,31.11 20.95,25.08 22.54,25.08 24.77,22.85 IC2.22
N$8
  Top 0.406: T1.2 R9.2 TP1.P$1
N$9
  Top 0.406: U$1.32 72.04,37.18 73.03,36.2 LD4.K
N$10
  Top 0.406: IC2.17 21.52,18.66 20.95,18.1 C15.2
N$11
  Top 0.406: R6.1 LD4.A
N$12
  Top 0.406: TX.K R.1
N$13
  Top 0.406: U$1.24 65.64,35.33 66.67,34.29 R8.1 72.39,33.34 74.68,31.05 Q2.2 74.68,24.83 C12.2
N$14
  Top 0.305: R.2 11.43,38.73 15.56,34.61 15.56,31.43 21.27,25.72 22.86,25.72 25.42,23.16 IC2.23
N$15
  Top 0.406: RX.K R4.1
PWM  (via drill 0.61)
  Top 0.406: U$1.14 58.2,41.91 55.88,41.91 v54.61,40.64
  Bottom 0.254: X3.3 43.95,64.95
  Bottom 0.406: v54.61,40.64 51.44,40.64 49.53,42.55 49.53,59.37 43.95,64.95
RS  (via drill 0.61)
  Top 0.305: U$1.39 67.56,45.16 v64.77,47.94
  Bottom 0.254: X3.6 45.45,67.26 v64.77,47.94
RST1
  Top 0.406: IC1.4 30.15,44.15 21.91,52.39 C11.2 D2.2 R1.2 18.41,59.69 14.92,63.18 11.43,63.18 | 11.43,63.18 4.45,63.18 3.49,64.14 JP1.5 | T2.A2 11.3,63.05 11.43,63.18
RST2
  Top 0.305: 62.23,8.26 62.23,5.4 JP2.5
  Top 0.406: U$1.20 62.44,37.04 61.59,36.2 R10.2 C13.2 54.61,36.2 53.66,35.24 53.66,26.35 | 53.66,26.35 53.66,16.83 56.2,14.29 | 56.2,14.29 62.23,8.26 | D3.2 53.66,26.35 | T3.A2 56.85,14.31 56.2,14.29
RXD
  Top 0.305: JP4.4 29.21,33.66 29.21,38.1 30.45,39.34 IC1.10
RXD_PIN  (via drill 0.61)
  Top 0.406: v19.68,11.43 JP3.1
  Bottom 0.406: JP4.2 30.48,22.23 v19.68,11.43
RXD_USB
  Top 0.406: IC2.5 26.07,31.71 JP4.6
SCK1
  Top 0.305: JP1.3 4.76,66.67 12.7,66.67 20.32,59.05
  Top 0.406: IC1.3 30.62,44.95 20.32,55.24 20.32,59.05
SCK2
  Top 0.305: 59.69,8.26 59.69,5.4 JP2.3
  Top 0.406: U$1.11 53.88,44.35 50.8,41.27 50.8,17.14 59.69,8.26
TXD
  Top 0.406: IC1.9 29.98,40.15 27.94,38.1 JP4.3
TXD_PIN  (via drill 0.61)
  Top 0.406: JP3.3 v18.41,13.97
  Bottom 0.305: 29.21,30.48 29.21,33.66 JP4.1
  Bottom 0.406: v18.41,13.97 20.95,13.97 29.21,22.23 29.21,30.48
TXD_USB
  Top 0.305: JP4.5 26.67,33.66 26.67,31.75 28.67,29.75 IC2.1
VBUS
  Bottom 1.016: LF1.2 C16.2 14.68,23.57 X1.VBUS

### Text on the board
tPlace: Designed by | David Leiter
tValues: + | TxD | USB | EXT | RxD | C | D | Serial | + | - | +